# Altium project Audio Prj.PrjPcb
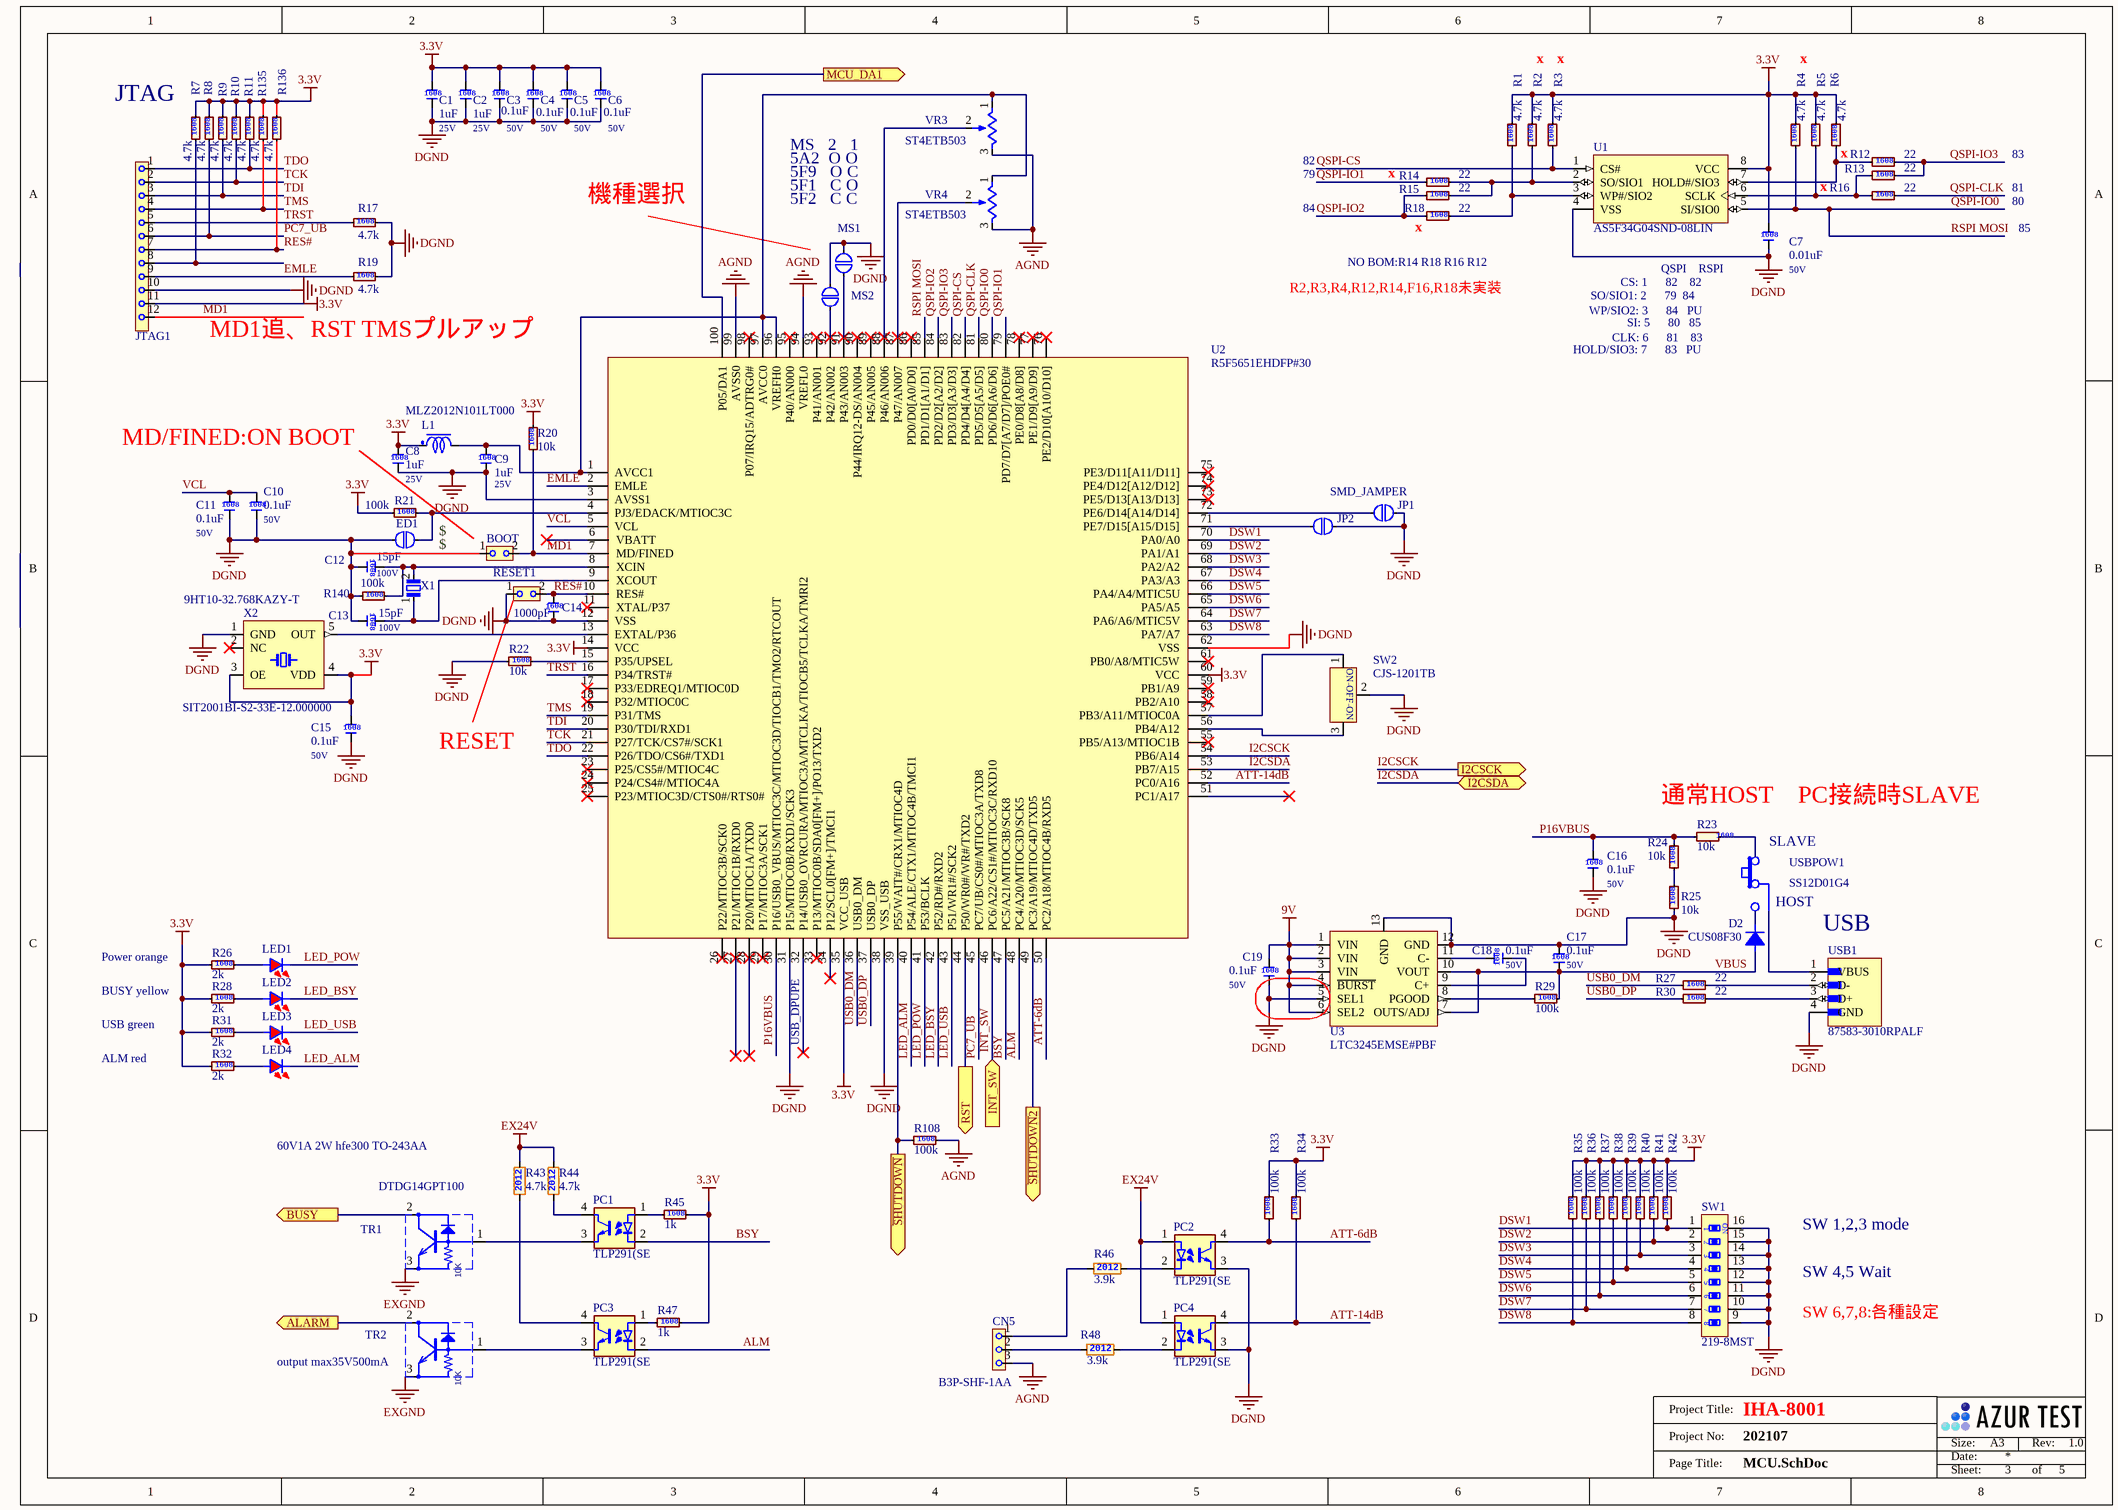
[diagram p0: MCU.SchDoc]
PRJ_Number: 202107; PRJ_Title: IHA-8001; SCH_Rev: 1.0
1 sheet, 103 parts. Net scope: flat (ports and power ports of the same name join across sheets).
Board file: PCB2.PcbDoc

## Sheet MCU.SchDoc
size A3; SheetNumber: 3; SheetTotal: 5

### Parts
BOOT  HEDDER2 2mm  [HDR1X2 2mm]  (value not drawn)
C1  Tag: 1uF  Voltage: 25V  [C1608]  (hidden comment: TMK107BJ105MA-T)
C2  Tag: 1uF  Voltage: 25V  [C1608]  (hidden comment: TMK107BJ105MA-T)
C3  Tag: 0.1uF  Voltage: 50V  [C1608]  (hidden comment: CGA3E2X7R1H104K080AA)
C4  Tag: 0.1uF  Voltage: 50V  [C1608]  (hidden comment: CGA3E2X7R1H104K080AA)
C5  Tag: 0.1uF  Voltage: 50V  [C1608]  (hidden comment: CGA3E2X7R1H104K080AA)
C6  Tag: 0.1uF  Voltage: 50V  [C1608]  (hidden comment: CGA3E2X7R1H104K080AA)
C7  Tag: 0.01uF  Voltage: 50V  [C1608]  (hidden comment: GCD188R71H103KA01D)
C8  Tag: 1uF  Voltage: 25V  [C1608]  (hidden comment: TMK107BJ105MA-T)
C9  Tag: 1uF  Voltage: 25V  [C1608]  (hidden comment: TMK107BJ105MA-T)
C10  Tag: 0.1uF  Voltage: 50V  [C1608]  (hidden comment: CGA3E2X7R1H104K080AA)
C11  Tag: 0.1uF  Voltage: 50V  [C1608]  (hidden comment: CGA3E2X7R1H104K080AA)
C12  Tag: 15pF  Voltage: 100V  [C1608]  (hidden comment: GCM1885C2A150FA16D)
C13  Tag: 15pF  Voltage: 100V  [C1608]  (hidden comment: GCM1885C2A150FA16D)
C14  Tag: 1000pF  [C1608]  (hidden comment: GCM1885C2A102JA16D)
C15  Tag: 0.1uF  Voltage: 50V  [C1608]  (hidden comment: CGA3E2X7R1H104K080AA)
C16  Tag: 0.1uF  Voltage: 50V  [C1608]  (hidden comment: CGA3E2X7R1H104K080AA)
C17  Tag: 0.1uF  Voltage: 50V  [C1608]  (hidden comment: CGA3E2X7R1H104K080AA)
C18  Tag: 0.1uF  Voltage: 50V  [C1608]  (hidden comment: CGA3E2X7R1H104K080AA)
C19  Tag: 0.1uF  Voltage: 50V  [C1608]  (hidden comment: CGA3E2X7R1H104K080AA)
CN5  B3P-SHF-1AA  [B3P-SHF-1AA]
D2  CUS08F30  [SOD-323]
ED1  SMD_JAMPER  [SMD_JAMPER -Cut]  (value not drawn)  (no BOM)
JP1  SMD_JAMPER  [SMD_JAMPER -Cut]  (no BOM)
JP2  SMD_JAMPER  [SMD_JAMPER -Cut]  (value not drawn)  (no BOM)
JTAG1  HEDDER12 2mm  [HDR1X12 2mm]  (value not drawn)
L1  MLZ2012N101LT000  [R2012]
LED1  APT1608LSECK/J4-PRV  [LED1608]  (value not drawn)
LED2  APT1608LSYCK/J3-PRV  [LED1608]  (value not drawn)
LED3  APT1608LZGCK  [LED1608]  (value not drawn)
LED4  APT1608LSECK/J3-PRV  [LED1608]  (value not drawn)
MS1  SMD_JAMPER  [SMD_JAMPER -Cut]  (value not drawn)  (no BOM)
MS2  SMD_JAMPER  [SMD_JAMPER -Cut]  (value not drawn)  (no BOM)
PC1  TLP291(SE  [SOP4]
PC2  TLP291(SE  [SOP4]
PC3  TLP291(SE  [SOP4]
PC4  TLP291(SE  [SOP4]
R1  Tag: 4.7k  [R1608]  (hidden comment: ERJ-PA3F4701V)
R2  Tag: 4.7k  [R1608]  (hidden comment: ERJ-PA3F4701V)  (net tie, no BOM)
R3  Tag: 4.7k  [R1608]  (hidden comment: ERJ-PA3F4701V)  (net tie, no BOM)
R4  Tag: 4.7k  [R1608]  (hidden comment: ERJ-PA3F4701V)  (net tie, no BOM)
R5  Tag: 4.7k  [R1608]  (hidden comment: ERJ-PA3F4701V)
R6  Tag: 4.7k  [R1608]  (hidden comment: ERJ-PA3F4701V)
R7  Tag: 4.7k  [R1608]  (hidden comment: ERJ-PA3F4701V)
R8  Tag: 4.7k  [R1608]  (hidden comment: ERJ-PA3F4701V)
R9  Tag: 4.7k  [R1608]  (hidden comment: ERJ-PA3F4701V)
R10  Tag: 4.7k  [R1608]  (hidden comment: ERJ-PA3F4701V)
R11  Tag: 4.7k  [R1608]  (hidden comment: ERJ-PA3F4701V)
R12  Tag: 22  [R1608]  (hidden comment: ERJ-PA3F22R0V)  (net tie, no BOM)
R13  Tag: 22  [R1608]  (hidden comment: ERJ-PA3F22R0V)
R14  Tag: 22  [R1608]  (hidden comment: ERJ-PA3F22R0V)  (net tie, no BOM)
R15  Tag: 22  [R1608]  (hidden comment: ERJ-PA3F22R0V)
R16  Tag: 22  [R1608]  (hidden comment: ERJ-PA3F22R0V)  (net tie, no BOM)
R17  Tag: 4.7k  [R1608]  (hidden comment: ERJ-PA3F4701V)
R18  Tag: 22  [R1608]  (hidden comment: ERJ-PA3F22R0V)  (net tie, no BOM)
R19  Tag: 4.7k  [R1608]  (hidden comment: ERJ-PA3F4701V)
R20  Tag: 10k  [R1608]  (hidden comment: ERJ-PA3F1002V)
R21  Tag: 100k  [R1608]  (hidden comment: ERJ-PA3F1003V)
R22  Tag: 10k  [R1608]  (hidden comment: ERJ-PA3F1002V)
R23  Tag: 10k  [R1608]  (hidden comment: ERJ-PA3F1002V)
R24  Tag: 10k  [R1608]  (hidden comment: ERJ-PA3F1002V)
R25  Tag: 10k  [R1608]  (hidden comment: ERJ-PA3F1002V)
R26  Tag: 2k  [R1608]  (hidden comment: ERJ-PA3F2001V)
R27  Tag: 22  [R1608]  (hidden comment: ERJ-PA3F22R0V)
R28  Tag: 2k  [R1608]  (hidden comment: ERJ-PA3F2001V)
R29  Tag: 100k  [R1608]  (hidden comment: ERJ-PA3F1003V)
R30  Tag: 22  [R1608]  (hidden comment: ERJ-PA3F22R0V)
R31  Tag: 2k  [R1608]  (hidden comment: ERJ-PA3F2001V)
R32  Tag: 2k  [R1608]  (hidden comment: ERJ-PA3F2001V)
R33  Tag: 100k  [R1608]  (hidden comment: ERJ-PA3F1003V)
R34  Tag: 100k  [R1608]  (hidden comment: ERJ-PA3F1003V)
R35  Tag: 100k  [R1608]  (hidden comment: ERJ-PA3F1003V)
R36  Tag: 100k  [R1608]  (hidden comment: ERJ-PA3F1003V)
R37  Tag: 100k  [R1608]  (hidden comment: ERJ-PA3F1003V)
R38  Tag: 100k  [R1608]  (hidden comment: ERJ-PA3F1003V)
R39  Tag: 100k  [R1608]  (hidden comment: ERJ-PA3F1003V)
R40  Tag: 100k  [R1608]  (hidden comment: ERJ-PA3F1003V)
R41  Tag: 100k  [R1608]  (hidden comment: ERJ-PA3F1003V)
R42  Tag: 100k  [R1608]  (hidden comment: ERJ-PA3F1003V)
R43  Tag: 4.7k  [R2012]  (hidden comment: RK73B2ATTD472J)
R44  Tag: 4.7k  [R2012]  (hidden comment: RK73B2ATTD472J)
R45  Tag: 1k  [R1608]  (hidden comment: ERJ-PA3F1001V)
R46  Tag: 3.9k  [R2012]  (hidden comment: RK73B2ATTD392J)
R47  Tag: 1k  [R1608]  (hidden comment: ERJ-PA3F1001V)
R48  Tag: 3.9k  [R2012]  (hidden comment: RK73B2ATTD392J)
R108  Tag: 100k  [R1608]  (hidden comment: ERJ-PA3F1003V)
R135  Tag: 4.7k  [R1608]  (hidden comment: ERJ-PA3F4701V)
R136  Tag: 4.7k  [R1608]  (hidden comment: ERJ-PA3F4701V)
R140  Tag: 100k  [R1608]  (hidden comment: ERJ-PA3F1003V)
RESET1  HEDDER2 2mm  [HDR1X2 2mm]  (value not drawn)
SW1  219-8MST  [219-8MST]
SW2  CJS-1201TB  [Slide Switch SPDT]
TR1  DTDG14GPT100  [SOT-89-3]
TR2  DTDG14GPT100  [SOT-89-3]  (value not drawn)
U1  AS5F34G04SND-08LIN  [8LGA(6x8)]
U2  R5F5651EHDFP#30  [LQFP100]
U3  LTC3245EMSE#PBF  [MSOP12]
USB1  87583-3010RPALF  [USB_2.0]
USBPOW1  SS12D01G4  [SS12D01G4]
VR3  ST4ETB503  [ST4ETB202]
VR4  ST4ETB503  [ST4ETB202]
X1  9HT10-32.768KAZY-T  [9HT10]  (net tie, no BOM)
X2  SIT2001BI-S2-33E-12.000000  [SOT-23-5]

### Ports
ALARM (out), BUSY (out), I2CSCK (out), I2CSDA (bidir), INT_SW (in), MCU_DA1 (out), RST (out), ~{SHUTDOWN}2 (out), ~{SHUTDOWN} (out)

### Nets
3.3V: C1.2 C2.2 C3.2 C4.2 C5.2 C6.2 C7.2 C8.2 C15.2 JTAG1.11 L1.1 R1.2 R2.2 R3.2 R4.2 R5.2 R6.2 R7.2 R8.2 R9.2 R10.2 R11.2 R20.2 R21.1 R26.1 R28.1 R31.1 R32.1 R33.2 R34.2 R35.2 R36.2 R37.2 R38.2 R39.2 R40.2 R41.2 R42.2 R45.2 R47.2 R135.2 R136.2 U1.8(VCC) U2.14(VCC) U2.35(VCC_USB) U2.60(VCC) X2.3(OE) X2.4(VDD)
9V: C19.2 U3.1(VIN) U3.2(VIN) U3.3(VIN) U3.4(~{BURST}) U3.6(SEL2)
AGND: CN5.3 R108.2 U2.94(VREFL0) U2.99(AVSS0) VR3.3 VR4.3
DGND: BOOT.1 C1.1 C2.1 C3.1 C4.1 C5.1 C6.1 C7.1 C8.1 C9.1 C10.1 C11.1 C12.1 C13.1 C14.1 C15.1 C16.1 C17.2 C19.1 ED1.1 JP1.2 JP2.2 JTAG1.10 MS1.1 MS2.1 PC2.3(E) PC4.3(E) R17.2 R19.2 R22.1 R25.1 R140.1 RESET1.1 SW1.9 SW1.10 SW1.11 SW1.12 SW1.13 SW1.14 SW1.15 SW1.16 SW2.2 U1.4(VSS) U2.3(AVSS1) U2.12(VSS) U2.31(P15/MTIOC0B/RXD1/SCK3) U2.38(VSS_USB) U2.62(VSS) U3.5(SEL1) U3.12(GND) U3.13(GND) USB1.4(GND) X2.1(GND)
EX24V: PC2.1(A-LED) PC4.1(A-LED) R43.2 R44.2
EXGND: TR1.3(OUT) TR2.3(OUT)
ALM: PC3.2(K-LED) U2.48(PC4/A20/MTIOC3D/SCK5)
ATT-6dB: PC2.4(C) R33.1 U2.50(PC2/A18/MTIOC4B/RXD5)
ATT-14dB: PC4.4(C) R34.1 U2.52(PC0/A16)
BSY: PC1.2(K-LED) U2.47(PC5/A21/MTIOC3B/SCK8)
DSW1: R42.1 SW1.1 U2.70(PA0/A0)
DSW2: R41.1 SW1.2 U2.69(PA1/A1)
DSW3: R40.1 SW1.3 U2.68(PA2/A2)
DSW4: R39.1 SW1.4 U2.67(PA3/A3)
DSW5: R38.1 SW1.5 U2.66(PA4/A4/MTIC5U)
DSW6: R37.1 SW1.6 U2.65(PA5/A5)
DSW7: R36.1 SW1.7 U2.64(PA6/A6/MTIC5V)
DSW8: R35.1 SW1.8 U2.63(PA7/A7)
EMLE: JTAG1.9 R19.1 U2.2(EMLE)
I2CSCK: U2.54(PB6/A14) ; port I2CSCK
I2CSDA: U2.53(PB7/A15) ; port I2CSDA
INT_SW: U2.46(PC6/A22/CS1#/MTIOC3C/RXD10) ; port INT_SW
LED_ALM: LED4.K U2.40(P54/ALE/CTX1/MTIOC4B/TMCI1)
LED_BSY: LED2.K U2.42(P52/RD#/RXD2)
LED_POW: LED1.K U2.41(P53/BCLK)
LED_USB: LED3.K U2.43(P51/WR1#/SCK2)
MD1: BOOT.2 JTAG1.12 R20.1 U2.7(MD/FINED)
P16VBUS: C16.2 R23.2 R24.2 U2.30(P16/USB0_VBUS/MTIOC3C/MTIOC3D/TIOCB1/TMO2/RTCOUT)
PC7_UB: JTAG1.6 R8.1 U2.45(PC7/UB/CS0#/MTIOC3A/TXD8)
QSPI-CLK: R16.2 U2.81(PD5/D5[A5/D5])
QSPI-CS: R3.1 U1.1(CS#) U2.82(PD4/D4[A4/D4])
QSPI-IO0: R4.1 U1.5(SI/SIO0) U2.80(PD6/D6[A6/D6]) U2.85(PD1/D1[A1/D1])  [also labelled RSPI MOSI]
QSPI-IO1: R14.1 U2.79(PD7/D7[A7/D7]/POE0#)
QSPI-IO2: R15.1 R18.1 U2.84(PD2/D2[A2/D2])
QSPI-IO3: R12.2 R13.2 U2.83(PD3/D3[A3/D3])
RES#: C14.2 JTAG1.7 R136.1 RESET1.2 U2.10(RES#)
TCK: JTAG1.2 R10.1 U2.21(P27/TCK/CS7#/SCK1)
TDI: JTAG1.3 R9.1 U2.20(P30/TDI/RXD1)
TDO: JTAG1.1 R11.1 U2.22(P26/TDO/CS6#/TXD1)
TMS: JTAG1.4 R135.1 U2.19(P31/TMS)
TRST: JTAG1.5 R17.1 U2.16(P34/TRST#)
USB0_DM: R27.1 U2.36(USB0_DM)
USB0_DP: R30.1 U2.37(USB0_DP)
VBUS: C17.1 D2.A R29.2 U3.7(OUTS/ADJ) U3.10(VOUT)
VCL: C10.2 C11.2 U2.5(VCL)
NetC9_2: C9.2 L1.2 U2.1(AVCC1) U2.96(VREFH0) U2.97(AVCC0) VR3.1 VR4.1
NetC12_2: C12.2 R140.2 U2.8(XCIN) X1.2
NetC13_2: C13.2 U2.9(XCOUT) X1.1
NetC18_1: C18.1 U3.9(C+)
NetC18_2: C18.2 U3.11(C-)
NetCN5_1: CN5.1 R46.1
NetCN5_2: CN5.2 R48.1
NetD2_K: D2.K USBPOW1.3
NetED1_2: ED1.2 R21.2 U2.4(PJ3/EDACK/MTIOC3C)
NetJP1_1: JP1.1 U2.72(PE6/D14[A14/D14])
NetJP2_1: JP2.1 U2.71(PE7/D15[A15/D15])
NetJTAG1_8: JTAG1.8 R7.1
NetLED1_A: LED1.A R26.2
NetLED2_A: LED2.A R28.2
NetLED3_A: LED3.A R31.2
NetLED4_A: LED4.A R32.2
NetMS1_2: MS1.2 U2.91(P43/AN003)
NetMS2_2: MS2.2 U2.92(P42/AN002)
NetPC1_1: PC1.1(A-LED) R45.1
NetPC1_3: PC1.3(E) TR1.1(IN)
NetPC1_4: PC1.4(C) R44.1
NetPC2_2: PC2.2(K-LED) R46.2
NetPC3_1: PC3.1(A-LED) R47.1
NetPC3_3: PC3.3(E) TR2.1(IN)
NetPC3_4: PC3.4(C) R43.1
NetPC4_2: PC4.2(K-LED) R48.2
NetR1_1: R1.1 R18.2 U1.3(WP#/SIO2)
NetR2_1: R2.1 R14.2 R15.2 U1.2(SO/SIO1)
NetR5_1: R5.1 R13.1 R16.1 U1.6(SCLK)
NetR6_1: R6.1 R12.1 U1.7(HOLD#/SIO3)
NetR22_2: R22.2 U2.15(P35/UPSEL)
NetR23_1: R23.1 USBPOW1.1
NetR24_1: R24.1 R25.2
NetR27_2: R27.2 USB1.2(D-)
NetR29_1: R29.1 U3.8(PGOOD)
NetR30_2: R30.2 USB1.3(D+)
NetR108_1: R108.1 U2.39(P55/WAIT#/CRX1/MTIOC4D) ; port ~{SHUTDOWN}
NetSW2_1: SW2.1 U2.57(PB3/A11/MTIOC0A)
NetSW2_3: SW2.3 U2.56(PB4/A12)
NetTR1_2: TR1.2(GND) ; port BUSY
NetTR2_2: TR2.2(GND) ; port ALARM
NetU2_13: U2.13(EXTAL/P36) X2.5(OUT)
NetU2_44: U2.44(P50/WR0#/WR#/TXD2) ; port RST
NetU2_49: U2.49(PC3/A19/MTIOC4D/TXD5) ; port ~{SHUTDOWN}2
NetU2_87: U2.87(P47/AN007) VR4.2
NetU2_88: U2.88(P46/AN006) VR3.2
NetU2_100: U2.100(P05/DA1) ; port MCU_DA1
NetUSB1_1: USB1.1(VBUS) USBPOW1.2

Not connected (* = marked no-connect by the designer): U2 6(VBATT)* 11(XTAL/P37)* 17(P33/EDREQ1/MTIOC0D)* 18(P32/MTIOC0C)* 23(P25/CS5#/MTIOC4C)* 24(P24/CS4#/MTIOC4A)* 25(P23/MTIOC3D/CTS0#/RTS0#)* 26(P22/MTIOC3B/SCK0)* 27(P21/MTIOC1B/RXD0)* 28(P20/MTIOC1A/TXD0)* 29(P17/MTIOC3A/SCK1)* 32(P14/USB0_OVRCURA/MTIOC3A/MTCLKA/TIOCB5/TCLKA/TMRI2)* 33(P13/MTIOC0B/SDA0[FM+]/PO13/TXD2)* 34(P12/SCL0[FM+]/TMCI1)* 51(PC1/A17)* 55(PB5/A13/MTIOC1B)* 58(PB2/A10)* 59(PB1/A9)* 61(PB0/A8/MTIC5W)* 73(PE5/D13[A13/D13])* 74(PE4/D12[A12/D12])* 75(PE3/D11[A11/D11])* 76(PE2/D10[A10/D10])* 77(PE1/D9[A9/D9])* 78(PE0/D8[A8/D8])* 86(PD0/D0[A0/D0])* 89(P45/AN005)* 90(P44/IRQ12-DS/AN004)* 93(P41/AN001)* 95(P40/AN000)* 98(P07/IRQ15/ADTRG0#)*; X2 2(NC)*

### Notes on the sheet
- JTAG
- x
- 5A2  O O
- 5F9   O C
- MS   2   1
- 79
- 82
- (near R6) x
- 83
- 機種選択
- 5F1   C O
- (near MS1) 5F2   C C
- 84
- (near R18) x
- 80
- 81
- 85
- R2,R3,R4,R12,R14,F16,R18未実装
- NO BOM:R14 R18 R16 R12
- WP/SIO2: 3      84   PU
- SO/SIO1: 2      79  84
- CS: 1      82    82
- QSPI    RSPI
- MD1追、RST TMSプルアップ
- HOLD/SIO3: 7      83   PU
- CLK: 6      81    83
- SI: 5      80   85
- MD/FINED:ON BOOT
- $
- RESET
- 通常HOST　PC接続時SLAVE
- (near USBPOW1) SLAVE
- (near USBPOW1) HOST
- Power orange
- BUSY yellow
- USB
- USB green
- (near U2) USB_DPUPE
- ALM red
- 60V1A 2W hfe300 TO-243AA
- SW 1,2,3 mode
- SW 4,5 Wait
- SW 6,7,8:各種設定
- (near TR2) output max35V500mA
- Project Title:
- Project No:
- Size:
- Date:
- A3
- Rev:
- Page Title:
- Sheet:
- of
- (in symbol 219-8MST) ON
- (in symbol C1608) 1608
- (in symbol CJS-1201TB) ON-OFF-ON
- (in symbol DTC114YKAT146_1) 10K
- (in symbol MF2012) 2012
- (in symbol TF1608) 1608

### Library data of the parts
BOOT RESET1 = HEDDER2 2mm: 雄,ストレート,1列2ピン; Vendor: 3M
C1 C2 C8 C9 = C1608: セラコン1608サイズ; Vendor: TaiyoYuden
C3-C6 C10 C11 C15-C19 = C1608: セラコン1608サイズ; Vendor: TDK
C7 C12 C13 = C1608: セラコン1608サイズ; Vendor: Murata
C14 = C1608: セラコン1608サイズ; Vendor: Murata; Voltage: 100V
CN5 = B3P-SHF-1AA: 雄,ストレート,1列3ピン; Vendor: JST
D2 = CUS08F30: DIODE SCHOTTKY 30V 800MA USC; Vendor: Toshiba
JTAG1 = HEDDER12 2mm: Vendor: 3M
L1 = MLZ2012: SMD Inductor 2012size; Vendor: TDK; Tag: 100uH
LED1 = LTST-C190CKT: LED 1608 orange; Vendor: kingbright; Color: Orange
LED2 = LTST-C190CKT: LED 1608 yellow; Vendor: kingbright; Color: yellow
LED3 = LTST-C190CKT: LED 1608 green; Vendor: kingbright; Color: green
LED4 = LTST-C190CKT: LED 1608 RED; Vendor: kingbright; Color: Red
PC1-PC4 = TLP291: PHOTOCOUPLER 1ch; Vendor: TOSHIBA
R1-R42 R45 R47 R108 R135 R136 R140 = TF1608: 厚膜チップ抵抗1608サイズ; Vendor: Panasonic
R43 R44 R46 R48 = MF2012: 薄膜チップ抵抗2012サイズ; Vendor: KOA
SW1 = 219-8MST: SMD DIP Switch; Vendor: CTS Electrocomponents
SW2 = CJS-1201TB: SWITCH SLIDE SPDT 100MA 6V; Vendor: Nidec Copal Electronics
TR1 TR2 = DTC114YKAT146_1: NPN  TR 1A with  Resi; Vendor: ROHM ローム
U1 = AS5F34G04SND-08LIN: IC FLASH 4GBIT SPI/QUAD I/O 8LGA; Vendor: Alliance Memory, Inc.
U2 = RX62NxxDFP  100pin: MCU; Vendor: Renesas; Manufactuer P/N: R5F5651EHDFP#30
U3 = LTC3245EMSE#PBF: IC REG CHARG PUMP ADJ/PRG 12MSOP; Vendor: Analog Devices Inc.
USB1 = 87583-3010RPALF: CONN RCPT USB2.0 TYPEA 4P SMD RA; Vendor: Amphenol ICC (FCI)
USBPOW1 = SS12D01G4: SPDTスライドスイッチ; Vendor: 秋月¦
VR3 VR4 = ST-32EA**: CERMET TRIMMER  Top adjustmet; Vendor: Nidec Copal Electronics; Tag: 50k
X1 = 9HT10-32.768KDZC-T: CRYSTAL 32kHz 3.2mm x 1.5mm; Vendor: TXC CORPORATION; Capacitance: 9pF; Tolerance: 20ppm; ESR: 70k
X2 = SIT2001BI-S2-33E-xxx: OSC MEMS ＳＯＴ－２３－５; Vendor: SiTime; Stability: 25ppm